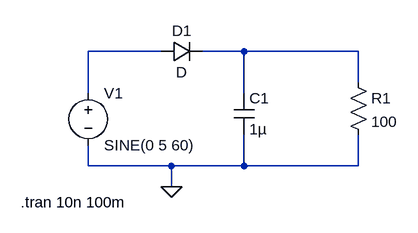
[diagram p0: schematic problem_352.asc]
problem_352.asc, the LTspice schematic file:
Version 4
SHEET 1 880 680
WIRE 80 80 -32 80
WIRE 208 80 144 80
WIRE 384 80 208 80
WIRE 384 128 384 80
WIRE -32 144 -32 80
WIRE 208 144 208 80
WIRE -32 256 -32 224
WIRE 96 256 -32 256
WIRE 208 256 208 208
WIRE 208 256 96 256
WIRE 384 256 384 208
WIRE 384 256 208 256
WIRE 96 288 96 256
FLAG 96 288 0
SYMBOL diode 80 96 R270
WINDOW 0 32 32 VTop 2
WINDOW 3 0 32 VBottom 2
SYMATTR InstName D1
SYMBOL cap 192 144 R0
SYMATTR InstName C1
SYMATTR Value 1µ
SYMBOL res 368 112 R0
SYMATTR InstName R1
SYMATTR Value 100
SYMBOL voltage -32 128 R0
WINDOW 123 0 0 Left 0
WINDOW 39 0 0 Left 0
SYMATTR InstName V1
SYMATTR Value SINE(0 5 60)
TEXT -136 312 Left 2 !.tran 10n 100m

The netlist it stands for:
* problem_352.asc
D1 N001 N002 D
C1 N002 0 1µ
R1 N002 0 100
V1 N001 0 SINE(0 5 60)
.model D D
.lib standard.dio
.tran 10n 100m
.backanno
.end